# Altium schematic sheet C-07 PWR MGR - 副本.SchDoc
size 513 x 386 mm
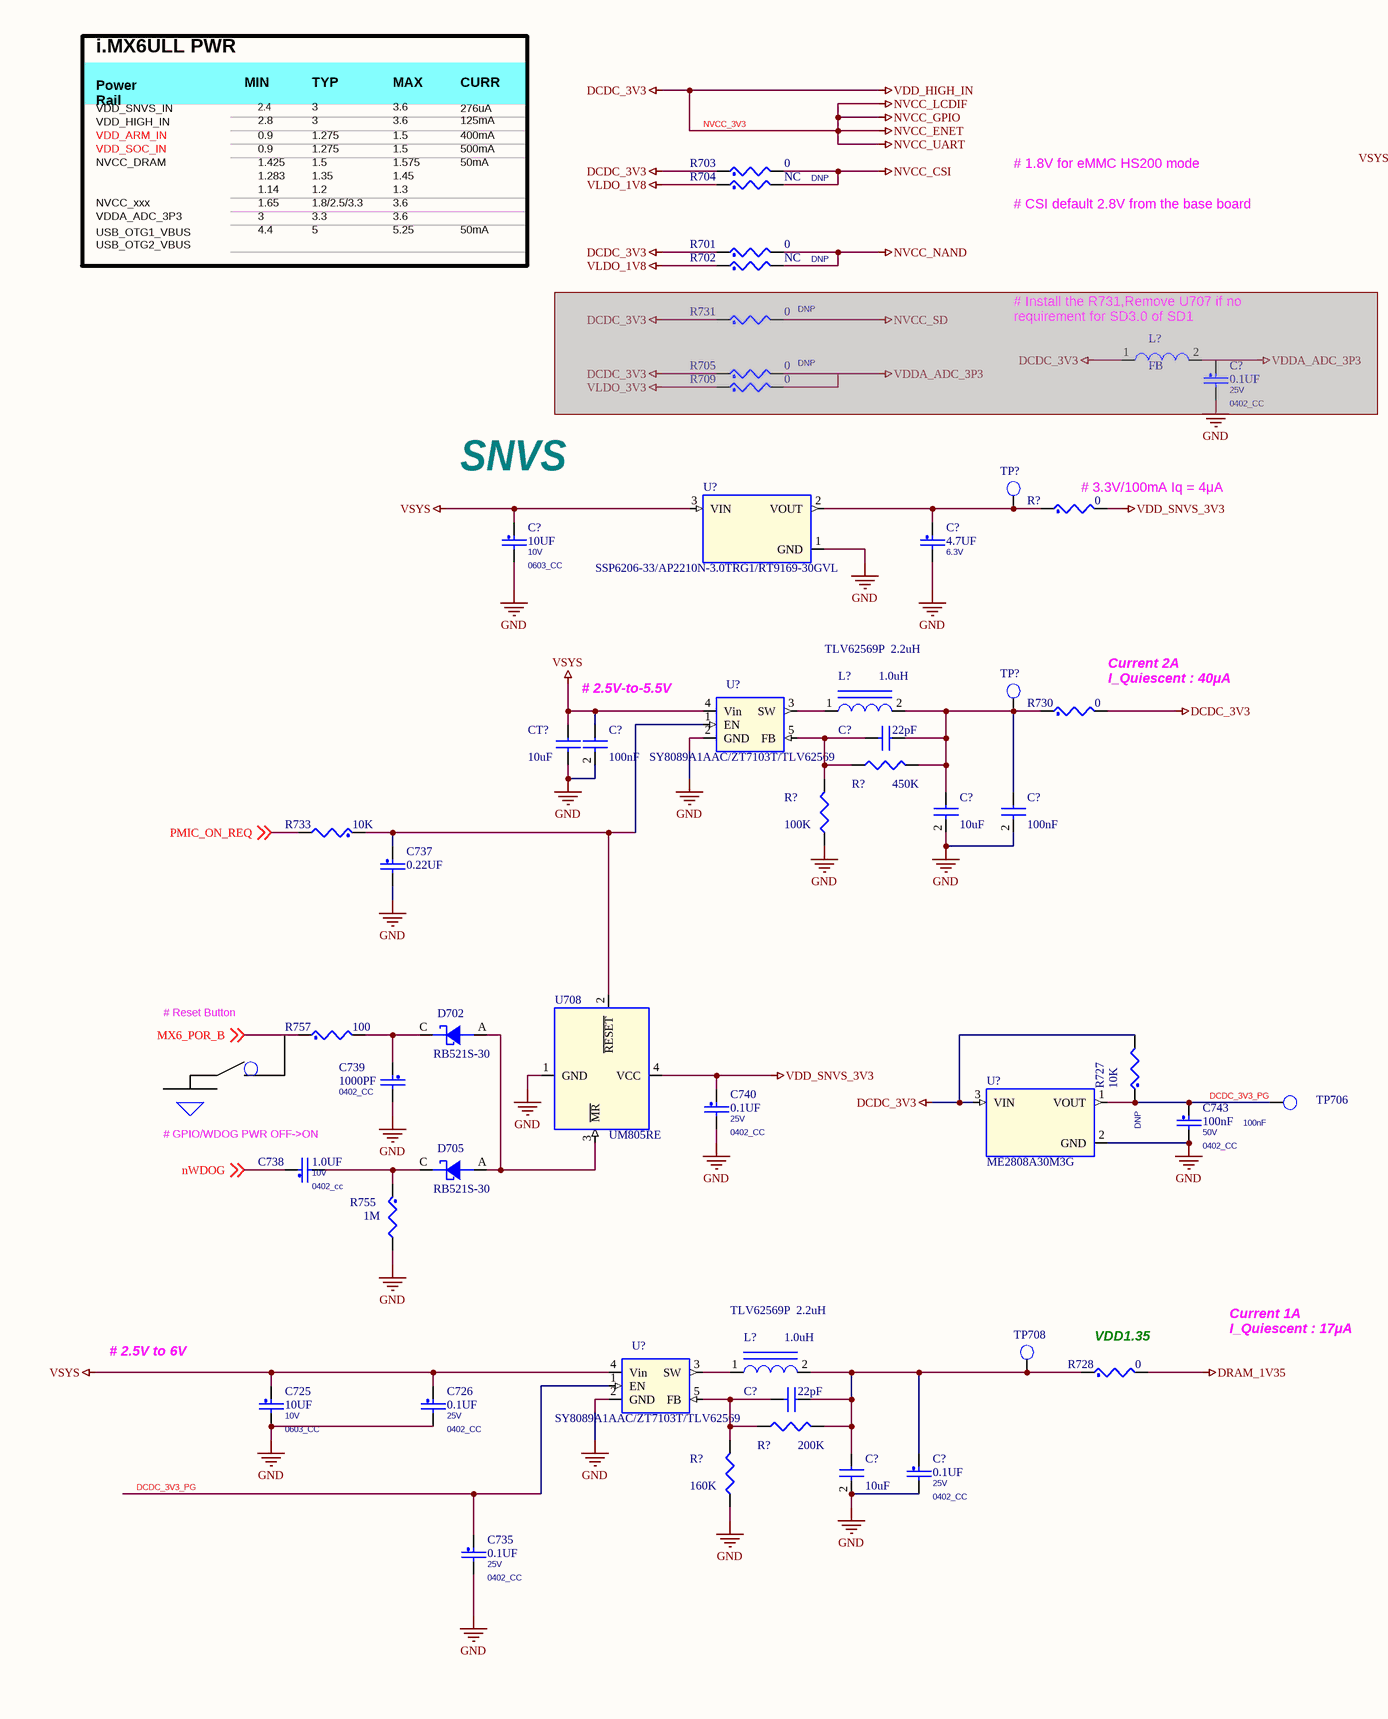
[diagram p0: C-07 PWR MGR - 副本.SchDoc, left]
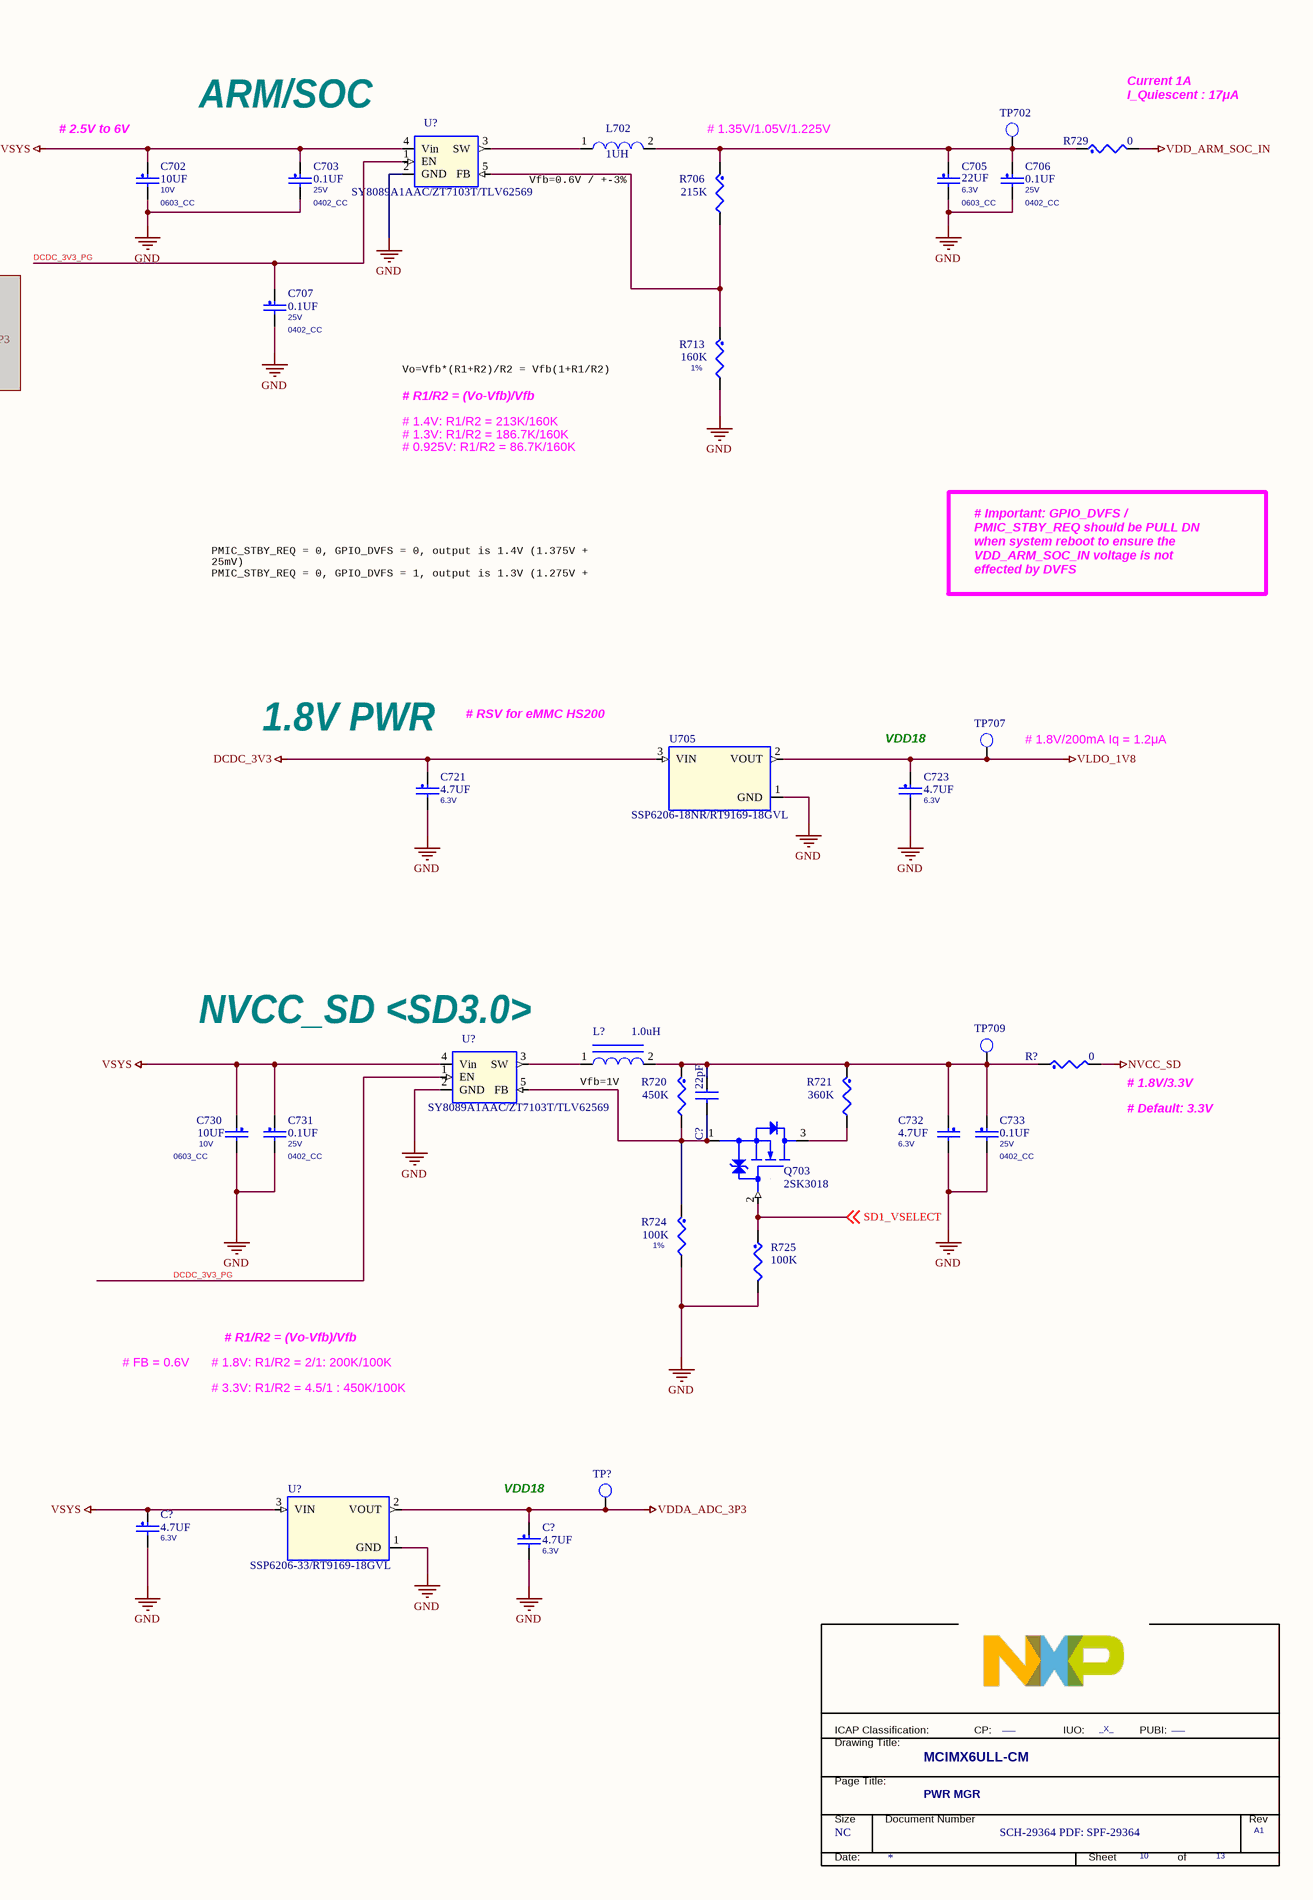
[diagram p1: C-07 PWR MGR - 副本.SchDoc, right]

## Parts
(Parts that share a designator on the sheet are numbered #1, #2 ... from top to bottom, then left to right.)
*  PageTitle: PWR MGR  Page Count: 13  Page Number: 10  Page Size: NC  Title: MCIMX6ULL-CM  RevCode: A1  Doc: SCH-29364 PDF: SPF-29364  FCP: ___  FIUO: _X_  (hidden comment: TitleBlock_FS)  (graphical)
C702  10UF  VOLTAGE: 10V  [0603_CC]
C703  0.1UF  VOLTAGE: 25V  [0402_CC]
C705  22UF  voltage rating: 6.3V  [0603_CC]
C706  0.1UF  VOLTAGE: 25V  [0402_CC]
C707  0.1UF  VOLTAGE: 25V  [0402_CC]
C721  4.7UF  voltage rating: 6.3V  [0402_CC]
C723  4.7UF  voltage rating: 6.3V  [0402_CC]
C725  10UF  VOLTAGE: 10V  [0603_CC]
C726  0.1UF  VOLTAGE: 25V  [0402_CC]
C730  10UF  VOLTAGE: 10V  [0603_CC]
C731  0.1UF  VOLTAGE: 25V  [0402_CC]
C732  4.7UF  voltage rating: 6.3V  [0402_CC]
C733  0.1UF  VOLTAGE: 25V  [0402_CC]
C735  0.1UF  VOLTAGE: 25V  [0402_CC]
C737  0.22UF  [0402_CC]
C738  1.0UF  VOLTAGE: 10V  [0402_cc]
C739  1000PF  [0402_CC]
C740  0.1UF  VOLTAGE: 25V  [0402_CC]
C743  100nF  VOLTAGE: 50V  [0402_CC]
C?#1  0.1UF  VOLTAGE: 25V  [0402_CC]  (masked out: inside a compile mask, not in the netlist)
C?#2  10UF  VOLTAGE: 10V  [0603_CC]
C?#3  4.7UF  voltage rating: 6.3V  [0402_CC]
C?#4  100nF  [C0603]
C?#5  22pF  [C0603]
C?#6  10uF  [C0603]
C?#7  100nF  [C0603]
C?#8  22pF  [C0603]
C?#9  22pF  [C0603]
C?#10  10uF  [C0603]
C?#11  0.1UF  VOLTAGE: 25V  [0402_CC]
C?#12  4.7UF  voltage rating: 6.3V  [0402_CC]
C?#13  4.7UF  voltage rating: 6.3V  [0402_CC]
CT?  10uF  [C0603]
D702  RB521S-30  [SOD523]
D705  RB521S-30  [SOD523]
L702  1UH  [ind_4020]
L?#1  FB  [L0603]  (masked out: inside a compile mask, not in the netlist)
L?#2  1.0uH  [SMTDR43-1]
L?#3  1.0uH  [SMTDR43-1]
L?#4  1.0uH  [SMTDR43-1]
Q703  2SK3018  [SOT323_3]
R701  0  [0402_CC]
R702  NC  ASSY_OPT: DNP  [0402_CC]
R703  0  [0402_CC]
R704  NC  ASSY_OPT: DNP  [0402_CC]
R705  0  ASSY_OPT: DNP  [0402_CC]  (masked out: inside a compile mask, not in the netlist)
R706  215K  [0402_CC]
R709  0  [0402_CC]  (masked out: inside a compile mask, not in the netlist)
R713  160K  Tolerance: 1%  [0402_CC]
R720  450K  [0402_CC]
R721  360K  [0402_CC]
R724  100K  Tolerance: 1%  [0402_CC]
R725  100K  [0402_CC]
R727  10K  ASSY_OPT: DNP  [0402_CC]
R728  0  [RC0805_OV]
R729  0  [RC0805_OV]
R730  0  [RC0805_OV]
R731  0  ASSY_OPT: DNP  [0402_CC]  (masked out: inside a compile mask, not in the netlist)
R733  10K  [0402_CC]
R755  1M  [0402_CC]
R757  100  [0402_CC]
R?#1  0  [RC0805_OV]
R?#2  450K  [R0603]
R?#3  100K  [R0603]
R?#4  0  [RC0805_OV]
R?#5  200K  [R0603]
R?#6  160K  [R0603]
TP702  TP_35MIL  [testpoint_35mil]  (value not drawn)
TP706  TP_35MIL  [testpoint_35mil]  (value not drawn)
TP707  TP_35MIL  [testpoint_35mil]  (value not drawn)
TP708  TP_35MIL  [testpoint_35mil]  (value not drawn)
TP709  TP_35MIL  [testpoint_35mil]  (value not drawn)
TP?#1  TP_35MIL  [testpoint_35mil]  (value not drawn)
TP?#2  TP_35MIL  [testpoint_35mil]  (value not drawn)
TP?#3  TP_35MIL  [testpoint_35mil]  (value not drawn)
U705  SSP6206-18NR/RT9169-18GVL  [SOT223]
U708  UM805RE  [sot_143]
U?#1  SY8089A1AAC/ZT7103T/TLV62569  [TSOT-25]
U?#2  SSP6206-33/AP2210N-3.0TRG1/RT9169-30GVL  [SOT223]
U?#3  SY8089A1AAC/ZT7103T/TLV62569  [TSOT-25]
U?#4  ME2808A30M3G  [SOT223]
U?#5  SY8089A1AAC/ZT7103T/TLV62569  [TSOT-25]
U?#6  SY8089A1AAC/ZT7103T/TLV62569  [TSOT-25]
U?#7  SSP6206-33/RT9169-18GVL  [SOT223]

## Nets
DRAM_1V35: R728.2
GND: C702.2 C703.2 C705.2 C706.2 C707.2 C721.2 C723.2 C725.2 C726.2 C730.2 C731.2 C732.2 C733.2 C735.2 C737.2 C739.2 C740.2 C743.2 C?#2.2 C?#3.2 C?#4.2 C?#6.2 C?#7.2 C?#10.2 C?#11.2 C?#12.2 C?#13.2 CT?.2 R713.2 R724.2 R725.2 R755.2 R?#3.2 R?#6.2 U705.1(GND) U708.1(GND) U?#1.2(GND) U?#2.1(GND) U?#3.2(GND) U?#4.2(GND) U?#5.2(GND) U?#6.2(GND) U?#7.1(GND)
NVCC_3V3: C721.1 R701.1 R703.1 R727.2 R730.2 U705.3(VIN) U?#4.3(VIN)  [also labelled DCDC_3V3, NVCC_ENET, NVCC_GPIO, NVCC_LCDIF, NVCC_UART, VDD_HIGH_IN]
NVCC_CSI: R703.2 R704.2
NVCC_NAND: R701.2 R702.2
NVCC_SD: R?#4.2
VDD_ARM_SOC_IN: R729.2
VDD_SNVS_3V3: C740.1 R?#1.2 U708.4(VCC)
VDDA_ADC_3P3: C?#13.1 TP?#3.1(TP) U?#7.2(VOUT)
VLDO_1V8: C723.1 R702.1 R704.1 TP707.1(TP) U705.2(VOUT)
VSYS: C702.1 C703.1 C725.1 C726.1 C730.1 C731.1 C?#2.1 C?#4.1 C?#12.1 CT?.1 U?#1.4(Vin) U?#2.3(VIN) U?#3.4(Vin) U?#5.4(Vin) U?#6.4(Vin) U?#7.3(VIN)
DCDC_3V3_PG: C707.1 C735.1 C743.1 R727.1 TP706.1(TP) U?#1.1(EN) U?#4.1(VOUT) U?#5.1(EN) U?#6.1(EN)
MX6_POR_B: R757.1 ; off-sheet MX6_POR_B
nWDOG: C738.1 ; off-sheet nWDOG
PMIC_ON_REQ: R733.2 ; off-sheet PMIC_ON_REQ
SD1_VSELECT: Q703.2(GATE) R725.1 ; off-sheet SD1_VSELECT
NetC705_1: C705.1 C706.1 L702.2 R706.1 R729.1 TP702.1(TP)
NetC732_1: C732.1 C733.1 C?#8.1 L?#3.2 R720.1 R721.1 R?#4.1 TP709.1(TP)
NetC737_1: C737.1 R733.1 U708.2(~{RESET}) U?#3.1(EN)
NetC738_2: C738.2 D705.C R755.1
NetC739_1: C739.1 D702.C R757.2
NetC?#3_1: C?#3.1 R?#1.1 TP?#1.1(TP) U?#2.2(VOUT)
NetC?#5_1: C?#5.1 C?#6.1 C?#7.1 L?#2.2 R730.1 R?#2.2 TP?#2.1(TP)
NetC?#5_2: C?#5.2 R?#2.1 R?#3.1 U?#3.5(FB)
NetC?#8_2: C?#8.2 Q703.1(SOURCE) R720.2 R724.1 U?#5.5(FB)
NetC?#9_1: C?#9.1 C?#10.1 C?#11.1 L?#4.2 R728.1 R?#5.2 TP708.1(TP)
NetC?#9_2: C?#9.2 R?#5.1 R?#6.1 U?#6.5(FB)
NetD702_A: D702.A D705.A U708.3(~{MR})
NetL702_1: L702.1 U?#1.3(SW)
NetL?#2_1: L?#2.1 U?#3.3(SW)
NetL?#3_1: L?#3.1 U?#5.3(SW)
NetL?#4_1: L?#4.1 U?#6.3(SW)
NetQ703_3: Q703.3(DRAIN) R721.2
NetR706_2: R706.2 R713.1 U?#1.5(FB)

## Notes on the sheet
- i.MX6ULL PWR
- VDD_SNVS_IN
- VDD_HIGH_IN
- Power
  Rail
- MIN
- 2.4
- 2.8
- TYP
- 3
- MAX
- 3.6
- CURR
- 276uA
- 125mA
- ARM/SOC
- (near R729) Current 1A
  I_Quiescent : 17μA
- VDD_SOC_IN
- VDD_ARM_IN
- NVCC_DRAM
- 0.9
- 1.425
- 1.283
- 1.14
- 1.275
- 1.5
- 1.35
- 1.2
- 1.575
- 1.45
- 1.3
- 400mA
- 500mA
- 50mA
- # 1.8V for eMMC HS200 mode
- (near C702) # 2.5V to 6V
- (near L702) Vfb=0.6V / +-3%
- (near R706) # 1.35V/1.05V/1.225V
- USB_OTG1_VBUS
  USB_OTG2_VBUS
- NVCC_xxx
- VDDA_ADC_3P3
- 1.65
- 4.4
- 1.8/2.5/3.3
- 3.3
- 5
- 5.25
- # CSI default 2.8V from the base board
- # Install the R731,Remove U707 if no
  requirement for SD3.0 of SD1
- Vo=Vfb*(R1+R2)/R2 = Vfb(1+R1/R2)
- # R1/R2 = (Vo-Vfb)/Vfb
- # 1.4V: R1/R2 = 213K/160K
- # 1.3V: R1/R2 = 186.7K/160K
- SNVS
- (near R?#1) # 3.3V/100mA Iq = 4μA
- # 0.925V: R1/R2 = 86.7K/160K
- TLV62569P  2.2uH
- PMIC_STBY_REQ = 0, GPIO_DVFS = 0, output is 1.4V (1.375V + 25mV)
  PMIC_STBY_REQ = 0, GPIO_DVFS = 1, output is 1.3V (1.275V + 25mV)
  PMIC_STBY_REQ = 1, GPIO_DVFS = 0, output is 0.925V (0.9V + 25mV)
- # Important: GPIO_DVFS /
  PMIC_STBY_REQ should be PULL DN
  when system reboot to ensure the
  VDD_ARM_SOC_IN voltage is not
  effected by DVFS
- # 2.5V-to-5.5V
- (near R730) Current 2A
  I_Quiescent : 40μA
- (near C721) 1.8V PWR
- # RSV for eMMC HS200
- (near C723) VDD18
- (near TP707) # 1.8V/200mA Iq = 1.2μA
- # Reset Button
- (near C738) # GPIO/WDOG PWR OFF->ON
- (near U?#5) NVCC_SD <SD3.0>
- (near L?#3) Vfb=1V
- (near R?#4) # 1.8V/3.3V
- # Default: 3.3V
- (near R728) VDD1.35
- Current 1A
  I_Quiescent : 17μA
- # 2.5V to 6V
- # FB = 0.6V
- # 1.8V: R1/R2 = 2/1: 200K/100K
- # 3.3V: R1/R2 = 4.5/1 : 450K/100K
- (near C?#13) VDD18
- (in symbol TitleBlock_FS) ICAP Classification:; CP:; IUO:; PUBI:; Drawing Title:; Page Title:; Size; Document Number; Rev; Date:; Sheet; of

## Library data of the parts
* = TitleBlock_FS: OrgAddr2: Austin, TX 78735-8598; OrgAddr1: 6501 William Cannon Drive West; OrgName: Freescale Semiconductor; Page Create Date: March  8, 1995; PUBI: ___; Page Modify Date: *
C702 C725 C730 C?#2 = CAP_NP: CAP CER 10UF 10V 20% X5R 0603; CLASS: DISCRETE; FPLIST: CC0603_OV,CC0603,0603_CC; CAD_APPROVED: Yes; MFG_PN01: LMK107BJ106MALTD; MFG_NAME01: TAIYO YUDEN; AGILE_PN: 150-78609; HEIGHT: 1.016MM; ROHS: Yes; PCB Footprint: 0603_CC
C703 C726 C735 C740 C?#11 = CAP_NP: CAP CER 0.1UF 25V 10% X5R 0402; CLASS: DISCRETE; FPLIST: CC0402_25,CC0402_HD,0402_CC; CAD_APPROVED: Yes; MFG_PN01: CC0402KRX5R8BB104; MFG_NAME01: YAGEO AMERICA; AGILE_PN: 150-78633; HEIGHT: 0.55MM; ROHS: Yes; Tolerance: 10%; PCB Footprint: 0402_CC
C705 = CAP_NP: CAP CER 22UF 6.3V 20% X5R 0603; CLASS: DISCRETE; FPLIST: CC0603_OV,CC0603,0603_CC; CAD_APPROVED: Yes; MFG_PN01: CL10A226MQ8NRNE; MFG_NAME01: Samsung; AGILE_PN: 150-78467; VOLTAGE: 6.3V; HEIGHT: 1MM; ROHS: Yes; Tolerance: 20%; PCB Footprint: 0603_CC
C706 C707 C731 C733 C?#1 = CAP_NP: CAP CER 0.1UF 25V 10% X5R 0402; CLASS: DISCRETE; AGILE_PN: 150-78633; MFG_NAME01: YAGEO AMERICA; MFG_PN01: CC0402KRX5R8BB104; CAD_APPROVED: Yes; FPLIST: CC0402_25,CC0402_HD,0402_CC; Tolerance: 10%; ROHS: Yes; HEIGHT: 0.55MM; PCB Footprint: 0402_CC
C721 C732 C?#3 C?#12 = CAP_NP: CAP CER 4.7UF 6.3V 20% X5R 0402; CLASS: DISCRETE; FPLIST: CC0402_25,CC0402_HD,0402_CC; CAD_APPROVED: Yes; MFG_PN01: C1005X5R0J475M050BC; MFG_NAME01: TDK; AGILE_PN: 150-78463; HEIGHT: 0.65MM; ROHS: Yes; Tolerance: 20%; VOLTAGE: 6.3V; PCB Footprint: 0402_CC
C723 C?#13 = CAP_NP: CAP CER 4.7UF 6.3V 20% X5R 0402; CLASS: DISCRETE; AGILE_PN: 150-78463; MFG_NAME01: TDK; MFG_PN01: C1005X5R0J475M050BC; CAD_APPROVED: Yes; FPLIST: CC0402_25,CC0402_HD,0402_CC; VOLTAGE: 6.3V; Tolerance: 20%; ROHS: Yes; HEIGHT: 0.65MM; PCB Footprint: 0402_CC
C737 = CAP_NP: CAP CER 0.22UF 10V 10% X5R 0402; CLASS: DISCRETE; AGILE_PN: 150-77358; MFG_NAME01: NIC COMPONENTS CORP; MFG_PN01: NMC0402X5R224K10TRPF; CAD_APPROVED: Yes; FPLIST: CC0402_25,CC0402_HD,0402_CC; PCB Footprint: 0402_CC; Tolerance: 10%; ROHS: Yes; HEIGHT: 0.55MM; VOLTAGE: 10V
C738 = CAP_NP: CAP CER 1.0UF 10V 10% X5R 0402; CLASS: DISCRETE; AGILE_PN: 150-75772; MFG_NAME01: YAGEO AMERICA; MFG_PN01: CC0402KRX5R6BB105; CAD_APPROVED: Yes; FPLIST: CC0402_25,CC0402_HD,0402_CC; ROHS: Yes; HEIGHT: 0.6MM; PCB Footprint: 0402_cc
C739 = CAP_NP: CAP CER 1000PF 50V 5% C0G 0402; CLASS: DISCRETE; FPLIST: CC0402_25,CC0402_HD,0402_CC; CAD_APPROVED: Yes; MFG_PN01: GRM1555C1H102JA01D; MFG_NAME01: MURATA; AGILE_PN: 150-76334; VOLTAGE: 50V; HEIGHT: 0.55MM; ROHS: Yes; Tolerance: 5%; PCB Footprint: 0402_CC
C743 = CAP_NP: CAP CER 50V 5% C0G 0402; CLASS: DISCRETE; AGILE_PN: 150-76334; MFG_NAME01: MURATA; MFG_PN01: GRM1555C1H102JA01D; CAD_APPROVED: Yes; FPLIST: CC0402_25,CC0402_HD,0402_CC; ASSY_OPT: 100nF; Tolerance: 5%; ROHS: Yes; HEIGHT: 0.55MM; PCB Footprint: 0402_CC
C?#4-C?#10 CT? = CAP NP: PCB Footprint: C0603
D702 = DIODE_SCHTKY: DIODE SCH 200MA 30V SOD-523; CLASS: IC; CAD_APPROVED: Yes; MFG_PN01: RB521S-30TE61; MFG_NAME01: ROHM; AGILE_PN: 480-75983; HEIGHT: 0.7MM; ROHS: Yes; PCB Footprint: SOD523
D705 = DIODE_SCHTKY: DIODE SCH 200MA 30V SOD-523; CLASS: IC; AGILE_PN: 480-75983; MFG_NAME01: ROHM; MFG_PN01: RB521S-30TE61; CAD_APPROVED: Yes; ROHS: Yes; HEIGHT: 0.7MM; PCB Footprint: SOD523
L702 = IND: IND PWR 1UH@100KHZ 2.6A 30% SMT; PART_TYPE: INDUCTOR\POWER; CLASS: DISCRETE; AGILE_PN: 180-77797; MFG_NAME01: Shenzhen Sunlord Electronics Co., Ltd; MFG_PN01: SWPA4020S1R0NT; CAD_APPROVED: Yes; Tolerance: 30%; TOL: 30%; ROHS: Yes; HEIGHT: 2.2MM; PCB Footprint: ind_4020
L?#1 = INDUCTOR_Dup2: PCB Footprint: L0603
L?#2-L?#4 = INDUCTOR IRON: PCB Footprint: SMTDR43
Q703 = 2SK3018: TRANS MOSFET N-CH 30V .1A SOT-323; CLASS: IC; AGILE_PN: 480-75317; MFG_NAME01: ROHM; MFG_PN01: 2SK3018T106; CAD_APPROVED: Yes; ROHS: Yes; HEIGHT: 0.9MM; PCB Footprint: SOT323_3
R701-R703 R709 = RES: RES MF ZERO OHM 1/16W 5% 0402; CLASS: DISCRETE; FPLIST: RC0402_25,RC0402_HD,RC0402_X2,0402_CC; CAD_APPROVED: Yes; MFG_PN01: MCR01MZPJ000; MFG_NAME01: ROHM; AGILE_PN: 470-75394; HEIGHT: 0.45 MM; ROHS: Yes; Tolerance: 5%; PCB Footprint: 0402_CC
R704 R705 R727 R731 = RES: RES MF ZERO OHM 1/16W 5% 0402; CLASS: DISCRETE; AGILE_PN: 470-75394; MFG_NAME01: ROHM; MFG_PN01: MCR01MZPJ000; CAD_APPROVED: Yes; FPLIST: RC0402_25,RC0402_HD,RC0402_X2,0402_CC; HEIGHT: 0.45 MM; Tolerance: 5%; ROHS: Yes; PCB Footprint: 0402_CC
R706 = RES: RES MF 215K 1/10W 1% AEC-Q200 0402; CLASS: DISCRETE; Temp_Range: -55C to +155C; FPLIST: RC0402_25,RC0402_HD,0402_CC; CAD_APPROVED: Yes; MFG_PN01: RK73H1ETTP2153F; MFG_NAME01: KOA SPEER; AGILE_PN: 470-31096; HEIGHT: 0.40 MM; ROHS: Yes; Tolerance: 1%; PCB Footprint: 0402_CC
R713 = RES: RES MF 160K 1/10W 1% AEC-Q200 0402; CLASS: DISCRETE; Temp_Range: -55C to +155C; AGILE_PN: 470-31082; MFG_NAME01: KOA SPEER; MFG_PN01: RK73H1ETTP1603F; CAD_APPROVED: Yes; FPLIST: RC0402_25,RC0402_HD,0402_CC; HEIGHT: 0.40 MM; ROHS: Yes; PCB Footprint: 0402_CC
R720 = RES: RES MF 464K 1/10W 1% AEC-Q200 0402; CLASS: DISCRETE; Temp_Range: -55C to +155C; FPLIST: RC0402_25,RC0402_HD,0402_CC; CAD_APPROVED: Yes; MFG_PN01: RK73H1ETTP4643F; MFG_NAME01: KOA SPEER; AGILE_PN: 470-31135; HEIGHT: 0.40 MM; ROHS: Yes; Tolerance: 1%; PCB Footprint: 0402_CC
R721 = RES: RES MF 243K 1/10W 1% AEC-Q200 0402; CLASS: DISCRETE; Temp_Range: -55C to +155C; FPLIST: RC0402_25,RC0402_HD,0402_CC; CAD_APPROVED: Yes; MFG_PN01: RK73H1ETTP2433F; MFG_NAME01: KOA SPEER; AGILE_PN: 470-31102; HEIGHT: 0.40 MM; ROHS: Yes; Tolerance: 1%; PCB Footprint: 0402_CC
R724 = RES: RES MF 200K 1/10W 1% AEC-Q200 0402; CLASS: DISCRETE; Temp_Range: -55C to +155C; AGILE_PN: 470-31093; MFG_NAME01: KOA SPEER; MFG_PN01: RK73H1ETTP2003F; CAD_APPROVED: Yes; FPLIST: RC0402_25,RC0402_HD,0402_CC; HEIGHT: 0.40 MM; ROHS: Yes; PCB Footprint: 0402_CC
R725 = RES: RES MF 100K 1/16W 5% 0402; CLASS: DISCRETE; Temp_Range: -55C to +155C; AGILE_PN: 470-75597; MFG_NAME01: VENKEL COMPANY; MFG_PN01: CR0402-16W-104JT; CAD_APPROVED: Yes; FPLIST: RC0402_25,RC0402_HD,0402_CC; HEIGHT: 0.40 MM; Tolerance: 5%; ROHS: Yes; PCB Footprint: 0402_CC
R728 R?#4 = RES: RES MF ZERO OHM 1/8W -- 0805; CLASS: DISCRETE; FPLIST: RC0805_OV,RC0805,RC0805_OV_3P,0805_CC; CAD_APPROVED: Yes; MFG_PN01: RC0805JR-070RL; MFG_NAME01: YAGEO AMERICA; Tolerance: 5%; AGILE_PN: 470-75442; HEIGHT: 0.7 MM; ROHS: Yes; PCB Footprint: RC0805_OV
R729 R730 R?#1 = RES: RES MF ZERO OHM 1/8W -- 0805; CLASS: DISCRETE; AGILE_PN: 470-75442; Tolerance: 5%; MFG_NAME01: YAGEO AMERICA; MFG_PN01: RC0805JR-070RL; CAD_APPROVED: Yes; FPLIST: RC0805_OV,RC0805,RC0805_OV_3P,0805_CC; HEIGHT: 0.7 MM; ROHS: Yes; PCB Footprint: RC0805_OV
R733 = RES: RES MF 10K 1/16W 5% 0402; CLASS: DISCRETE; FPLIST: RC0402_25,RC0402_HD,0402_CC; CAD_APPROVED: Yes; MFG_PN01: CRCW040210K0JNED; MFG_NAME01: VISHAY INTERTECHNOLOGY; AGILE_PN: 470-75557; HEIGHT: 0.4 MM; ROHS: Yes; Tolerance: 5%; PCB Footprint: 0402_CC
R755 = RES: RES MF 1M 1/10W 5% AEC-Q200 0402; CLASS: DISCRETE; Temp_Range: -55&#8451; to 155&#8451;; AGILE_PN: 470-79978; MFG_NAME01: KOA SPEER; MFG_PN01: RK73B1ETTP105J; CAD_APPROVED: Yes; FPLIST: RC0402_25,RC0402_HD,0402_CC; HEIGHT: 0.4MM; Tolerance: 5%; ROHS: Yes; PCB Footprint: 0402_CC
R757 = RES: RES MF 100 OHM 1/16W 1% 0402; CLASS: DISCRETE; AGILE_PN: 470-30454; MFG_NAME01: THYE MING TECH CO LTD; MFG_PN01: CR-02FL6--100R; CAD_APPROVED: Yes; FPLIST: RC0402_25,RC0402_HD,0402_CC; HEIGHT: 0.4 MM; Tolerance: 1%; ROHS: Yes; PCB Footprint: 0402_CC
R?#2 R?#3 R?#5 R?#6 = R_Dup2: PCB Footprint: R0603
TP702 TP709 TP?#1 TP?#2 = T POINT R: TEST POINT PAD .035 SMT, no part to order; CLASS: IC; AGILE_PN: 510-75618; CAD_APPROVED: Yes; ROHS: Yes; HEIGHT: 0.1MM; PCB Footprint: testpoint_35mil
TP706-TP708 TP?#3 = T POINT R: TEST POINT PAD .035 SMT, no part to order; CLASS: IC; CAD_APPROVED: Yes; AGILE_PN: 510-75618; HEIGHT: 0.1MM; ROHS: Yes; PCB Footprint: testpoint_35mil
U705 U?#7 = RT9169_3P: IC VREG LDO 1.8V 100mA 2-6V SOT-23-3; CAD_APPROVED: Yes; MFG_NAME01: Richtek; AGILE_PN: 315-80514; PCB Footprint: sot23-3-1p95; CLASS: IC; HEIGHT: 1.295MM; ROHS: Yes; MFG_PN01: RT9169-18GVL
U708 = UM805_4P: IC VOLT MONITOR 2.63V VTH RST 1-5.5V SOT143; AGILE_PN: 315-80564; MFG_NAME01: Union Semiconductor, Inc; CAD_APPROVED: Yes; CLASS: IC; MFG_PN01: UM805RE; ROHS: Yes; HEIGHT: 1.22MM; PCB Footprint: sot_143
U?#1 U?#3 U?#5 U?#6 = ZT7103S_0: PCB Footprint: TSOT-25
U?#2 = RT9169_3P: IC VREG LDO 3.3V 100mA 2-6V SOT-23-3; AGILE_PN: 315-80510; MFG_NAME01: Richtek; MFG_PN01: RT9169-33GVL; CAD_APPROVED: Yes; PCB Footprint: sot23-3-1p95; CLASS: IC; ROHS: Yes; HEIGHT: 1.295MM
U?#4 = RT9169_3P: IC VREG LDO 1.8V 100mA 2-6V SOT-23-3; CAD_APPROVED: Yes; MFG_PN01: RT9169-18GVL; MFG_NAME01: Richtek; AGILE_PN: 315-80514; PCB Footprint: sot23-3-1p95; CLASS: IC; HEIGHT: 1.295MM; ROHS: Yes